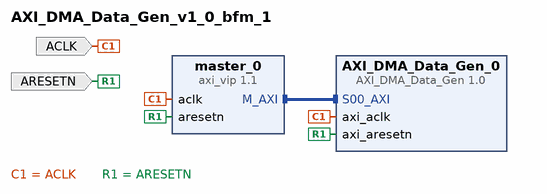
[diagram p0: block diagram of the top level]
# Vivado block design AXI_DMA_Data_Gen_v1_0_bfm_1, xczu9eg-ffvc900-1-i-es1, Vivado 2017.4_AR70593
create_bd_design AXI_DMA_Data_Gen_v1_0_bfm_1

create_bd_port -dir I -type clk ACLK
set_property -dict [list \
  CONFIG.FREQ_HZ 100000000 \
  CONFIG.PHASE 0.000 \
  CONFIG.CLK_DOMAIN AXI_DMA_Data_Gen_v1_0_bfm_1_ACLK \
  CONFIG.ASSOCIATED_RESET ARESETN \
] [get_bd_ports ACLK]
create_bd_port -dir I -type rst ARESETN
set_property -dict {CONFIG.POLARITY ACTIVE_LOW} [get_bd_ports ARESETN]

create_bd_cell -type ip -vlnv xilinx.com:ip:axi_vip:1.1 master_0
set_property -dict [list \
  CONFIG.PROTOCOL AXI4LITE \
  CONFIG.READ_WRITE_MODE READ_WRITE \
  CONFIG.INTERFACE_MODE MASTER \
  CONFIG.ADDR_WIDTH 32 \
  CONFIG.DATA_WIDTH 32 \
  CONFIG.HAS_PROT 1 \
  CONFIG.HAS_WSTRB 1 \
  CONFIG.HAS_BRESP 1 \
  CONFIG.HAS_RRESP 1 \
] [get_bd_cells master_0]
create_bd_cell -type ip -vlnv xilinx.com:user:AXI_DMA_Data_Gen:1.0 AXI_DMA_Data_Gen_0

# ---- connections ----

connect_bd_intf_net [get_bd_intf_pins master_0/M_AXI] [get_bd_intf_pins AXI_DMA_Data_Gen_0/S00_AXI]
connect_bd_net -net aclk_net [get_bd_ports ACLK] [get_bd_pins master_0/aclk] [get_bd_pins AXI_DMA_Data_Gen_0/axi_aclk]
connect_bd_net -net aresetn_net [get_bd_ports ARESETN] [get_bd_pins master_0/aresetn] [get_bd_pins AXI_DMA_Data_Gen_0/axi_aresetn]

# ---- address map ----
assign_bd_address -offset 0x44A00000 -range 64K -target_address_space [get_bd_addr_spaces master_0/Master_AXI] [get_bd_addr_segs AXI_DMA_Data_Gen_0/S00_AXI/S00_AXI_reg]

validate_bd_design
save_bd_design
